# Altium project BUCK-BOOST_PFC_Mainboard.PrjPcb
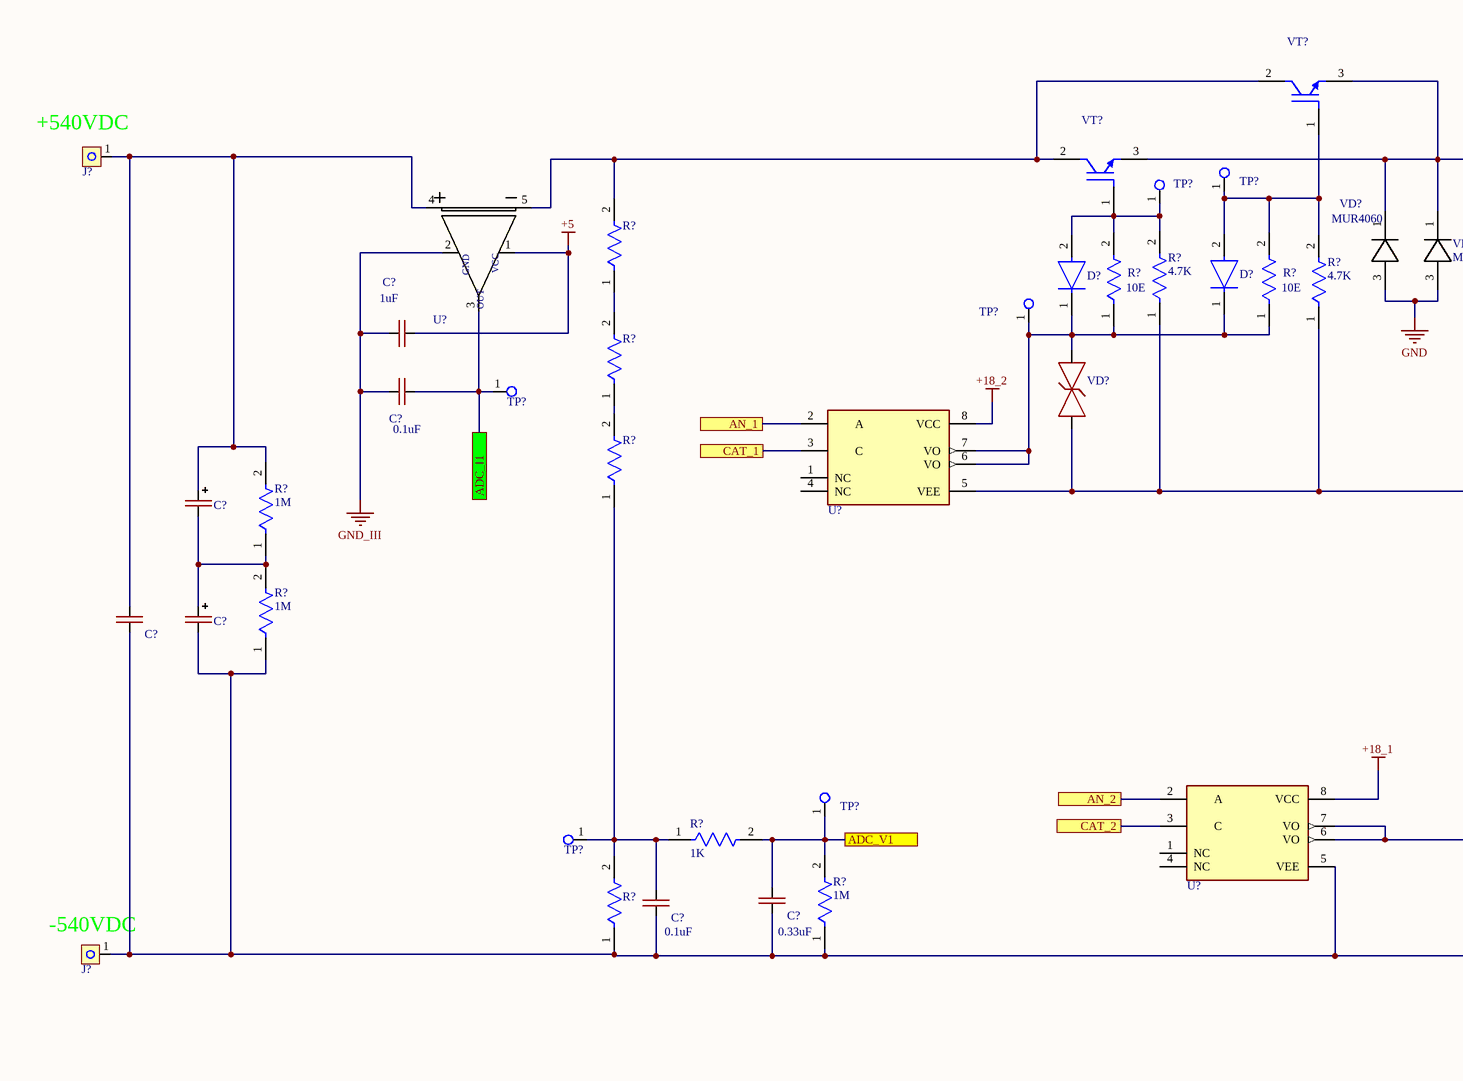
[diagram p0: BUCK-BOOST_PFC_Mainboard_.SchDoc, top left]
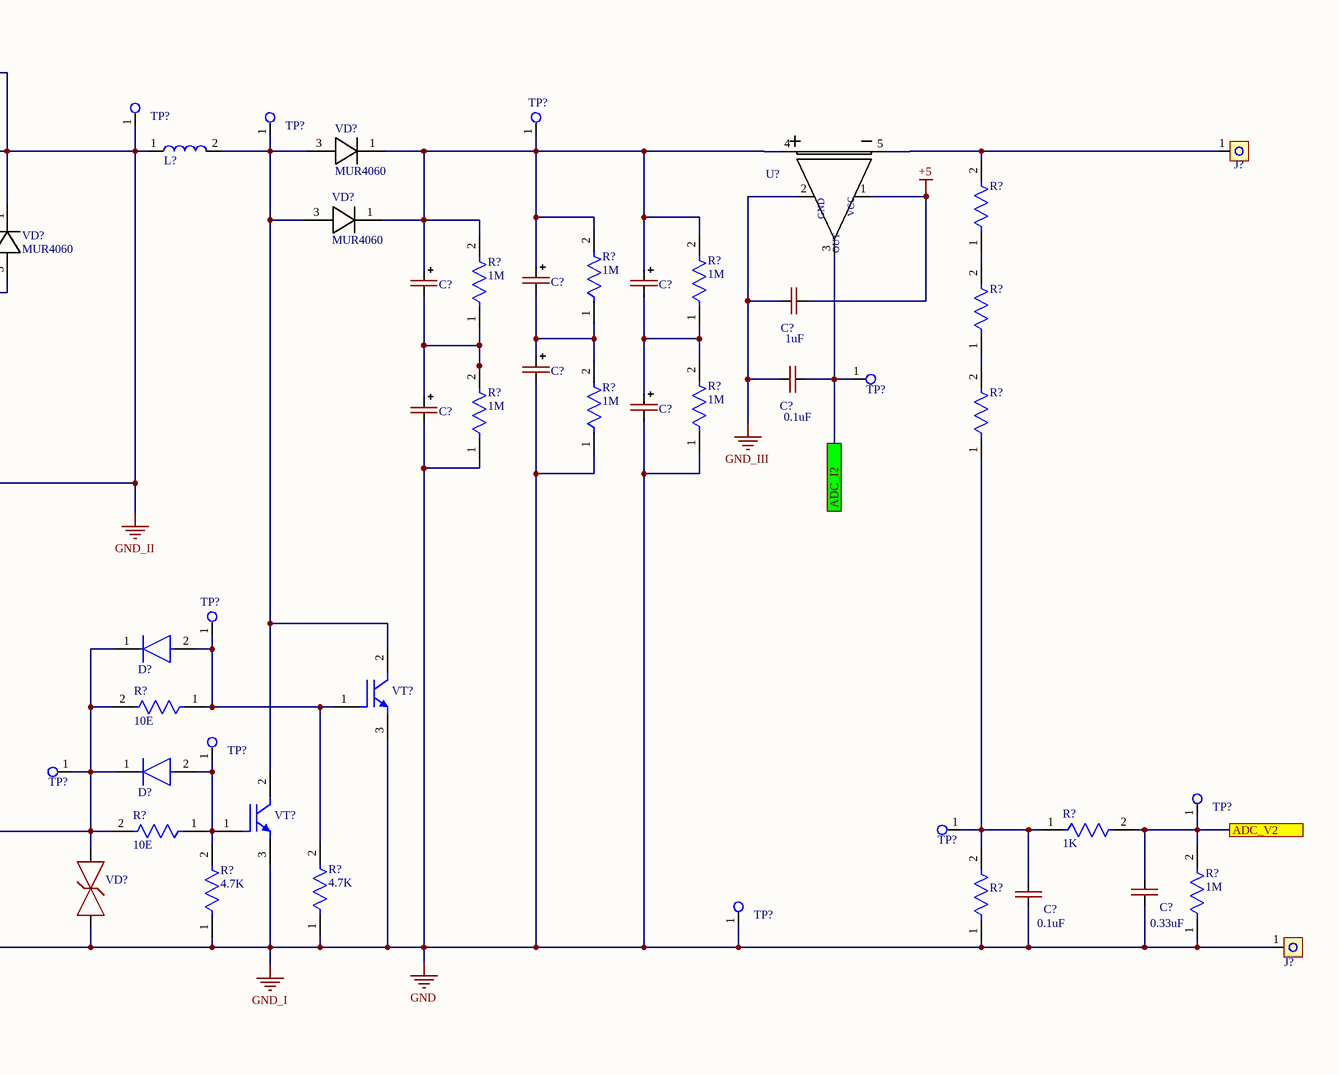
[diagram p1: BUCK-BOOST_PFC_Mainboard_.SchDoc, top right]
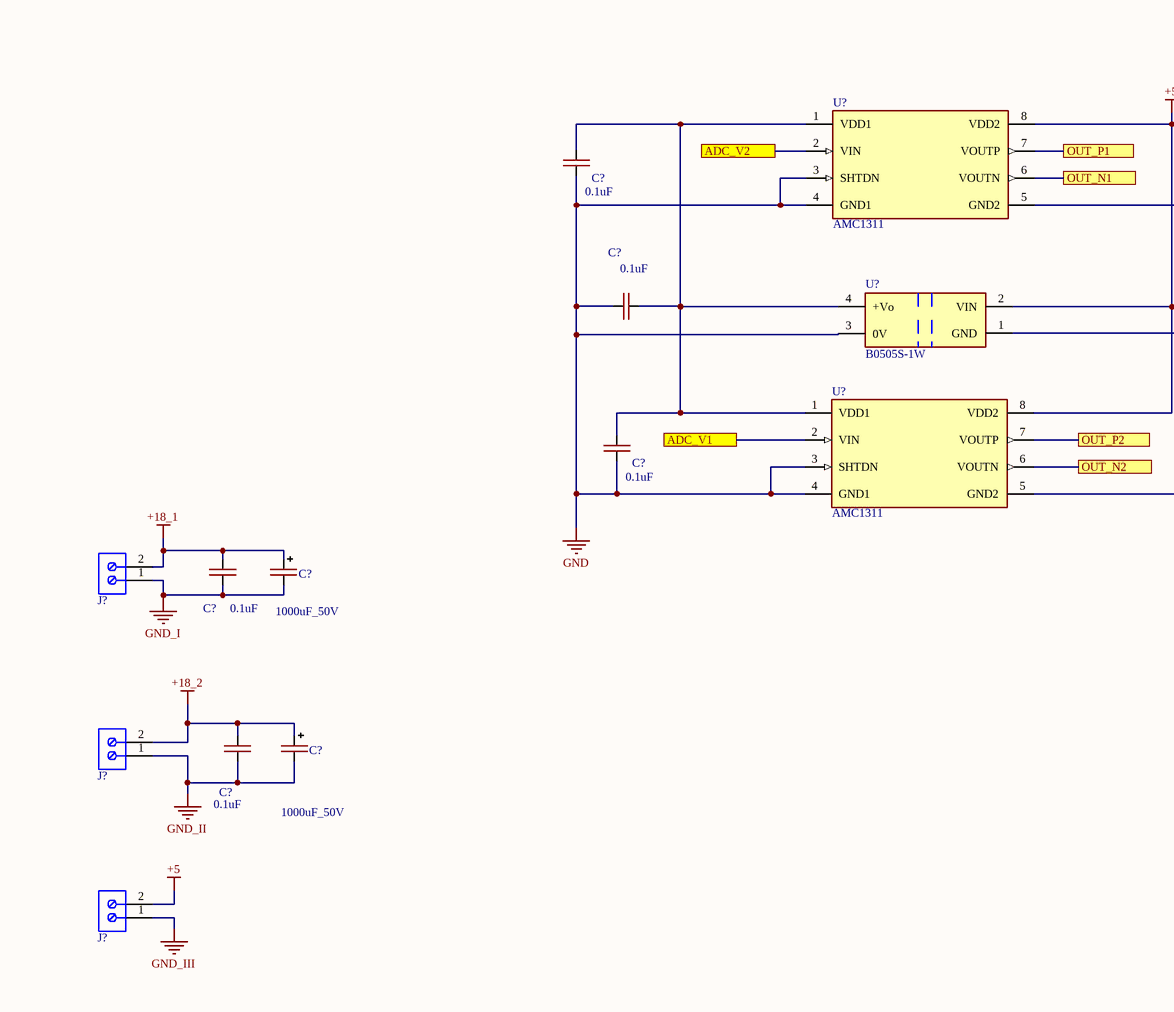
[diagram p2: BUCK-BOOST_PFC_Mainboard_.SchDoc, bottom left]
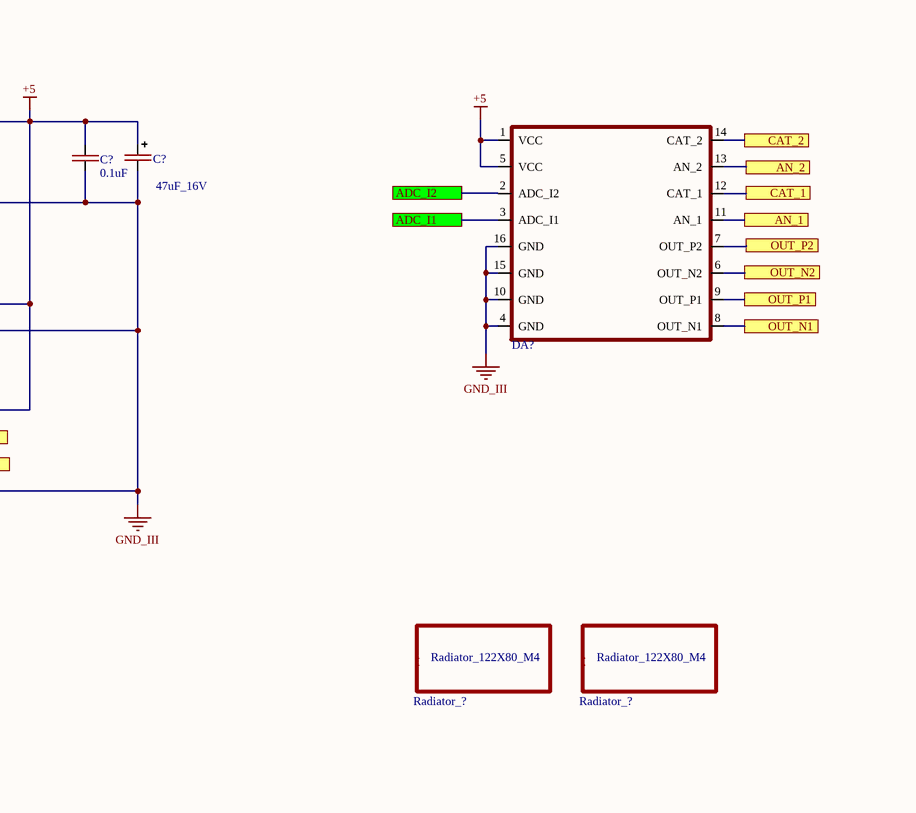
[diagram p3: BUCK-BOOST_PFC_Mainboard_.SchDoc, bottom right]
1 sheet, 102 parts. Net scope: flat (ports and power ports of the same name join across sheets).
Board file: BUCK-BOOST_PFC_Mainboard.PcbDoc

## Sheet BUCK-BOOST_PFC_Mainboard_.SchDoc
size A0; SheetNumber: 1; SheetTotal: 1; SPICEModelCacheFPQAHQWD: <root> / <DocumentId>FPQAHQWD</DocumentId> / </root>

### Parts
(Parts that share a designator on the sheet are numbered #1, #2 ... from top to bottom, then left to right.)
C?#1  CAP-POLAR  [CAP 100uF_500V 22x40mm]  (value not drawn)
C?#2  CAP-POLAR  [CAP 100uF_500V 22x40mm]  (value not drawn)
C?#3  CAP-POLAR  [CAP 100uF_500V 22x40mm]  (value not drawn)
C?#4  1uF  [CAP-0805]
C?#5  1uF  [CAP-0805]
C?#6  CAP-POLAR  [CAP 100uF_500V 22x40mm]  (value not drawn)
C?#7  0.1uF  [CAP-0805]
C?#8  0.1uF  [CAP-0805]
C?#9  CAP-POLAR  [CAP 100uF_500V 22x40mm]  (value not drawn)
C?#10  CAP-POLAR  [CAP 100uF_500V 22x40mm]  (value not drawn)
C?#11  CAP-POLAR  [CAP_POL_36X60]  (value not drawn)
C?#12  CAP-NON-POLAR  [CAP_4.7uF_630V]  (value not drawn)
C?#13  CAP-POLAR  [CAP_POL_36X60]  (value not drawn)
C?#14  0.1uF  [CAP-0805]
C?#15  0.33uF  [CAP-0805]
C?#16  0.1uF  [CAP-0805]
C?#17  0.33uF  [CAP-0805]
C?#18  0.1uF  [CAP-0805]
C?#19  0.1uF  [CAP-0805]
C?#20  47uF_16V  [CAP-TAN-D]
C?#21  0.1uF  [CAP-0805]
C?#22  0.1uF  [CAP-0805]
C?#23  0.1uF  [CAP-0805]
C?#24  1000uF_50V  [CAPPOL-16x25]
C?#25  0.1uF  [CAP-0805]
C?#26  1000uF_50V  [CAPPOL-16x25]
D?#1  US1G  [DO-214AA]  (value not drawn)
D?#2  US1G  [DO-214AA]  (value not drawn)
D?#3  US1G  [DO-214AA]  (value not drawn)
D?#4  US1G  [DO-214AA]  (value not drawn)
DA?  BOARD_PFC  [BOARD_PFC]  (value not drawn)
J?#1  MG_136_HT  [Conn_MEIGAN_MG136HT]  (value not drawn)
J?#2  MG_136_HT  [Conn_MEIGAN_MG136HT]  (value not drawn)
J?#3  MG_136_HT  [Conn_MEIGAN_MG136HT]  (value not drawn)
J?#4  MG_136_HT  [Conn_MEIGAN_MG136HT]  (value not drawn)
J?#5  691102710002  [691102710002]  (value not drawn)
J?#6  691102710002  [691102710002]  (value not drawn)
J?#7  691102710002  [691102710002]  (value not drawn)
L?  Coil  [30A_10uH]  (value not drawn)
R?#1  (no value)  [RES-2512]
R?#2  (no value)  [RES-2512]
R?#3  10E  [RES_SMD_1210_IPC_A]
R?#4  4.7K  [RES-0805]
R?#5  10E  [RES_SMD_1210_IPC_A]
R?#6  4.7K  [RES-0805]
R?#7  1M  [RES-2512]
R?#8  1M  [RES-2512]
R?#9  1M  [RES-2512]
R?#10  (no value)  [RES-2512]
R?#11  (no value)  [RES-2512]
R?#12  1M  [RES-2512]
R?#13  1M  [RES-2512]
R?#14  1M  [RES-2512]
R?#15  (no value)  [RES-2512]
R?#16  (no value)  [RES-2512]
R?#17  1M  [RES-2512]
R?#18  1M  [RES-2512]
R?#19  10E  [RES_SMD_1210_IPC_A]
R?#20  1K  [RES-0805]
R?#21  10E  [RES_SMD_1210_IPC_A]
R?#22  1K  [RES-0805]
R?#23  RES_1210  [RES_SMD_1210_IPC_B]  (value not drawn)
R?#24  1M  [RES-0805]
R?#25  4.7K  [RES-0805]
R?#26  4.7K  [RES-0805]
R?#27  RES_1210  [RES_SMD_1210_IPC_B]  (value not drawn)
R?#28  1M  [RES-0805]
Radiator_?#1  Radiator_122X80_M4  [Radiator_122X80_M4]  (value not drawn)
Radiator_?#2  Radiator_122X80_M4  [Radiator_122X80_M4]  (value not drawn)
TP?#1  Test_Point_PCB  [Test_Point]  (value not drawn)
TP?#2  Test_Point_PCB  [Test_Point]  (value not drawn)
TP?#3  Test_Point_PCB  [Test_Point]  (value not drawn)
TP?#4  Test_Point_PCB  [Test_Point]  (value not drawn)
TP?#5  Test_Point_PCB  [Test_Point]  (value not drawn)
TP?#6  Test_Point_PCB  [Test_Point]  (value not drawn)
TP?#7  Test_Point_PCB  [Test_Point]  (value not drawn)
TP?#8  Test_Point_PCB  [Test_Point]  (value not drawn)
TP?#9  Test_Point_PCB  [Test_Point]  (value not drawn)
TP?#10  Test_Point_PCB  [Test_Point]  (value not drawn)
TP?#11  Test_Point_PCB  [Test_Point]  (value not drawn)
TP?#12  Test_Point_PCB  [Test_Point]  (value not drawn)
TP?#13  Test_Point_PCB  [Test_Point]  (value not drawn)
TP?#14  Test_Point_PCB  [Test_Point]  (value not drawn)
TP?#15  Test_Point_PCB  [Test_Point]  (value not drawn)
TP?#16  Test_Point_PCB  [Test_Point]  (value not drawn)
U?#1  ACS758  [ACS758-100]  (value not drawn)
U?#2  ACS758  [ACS758-100]  (value not drawn)
U?#3  HCPL-3120  [HCPL-3120]  (value not drawn)
U?#4  HCPL-3120  [HCPL-3120]  (value not drawn)
U?#5  AMC1311  [FP-DWV0008A-MFG]
U?#6  B0505S-1W  [B0505S-1W]
U?#7  AMC1311  [FP-DWV0008A-MFG]
VD?#1  MUR4060  [TO-247-2]
VD?#2  MUR4060  [TO-247-2]
VD?#3  MUR4060  [TO-247-2]
VD?#4  MUR4060  [TO-247-2]
VD?#5  Suppressor  [DO-214AA]  (value not drawn)
VD?#6  Suppressor  [DO-214AA]  (value not drawn)
VT?#1  IGBT 60N120T  [TO-264-3]  (value not drawn)
VT?#2  IGBT 60N120T  [TO-264-3]  (value not drawn)
VT?#3  IGBT 60N120T  [TO-264-3]  (value not drawn)
VT?#4  IGBT 60N120T  [TO-264-3]  (value not drawn)

### Ports
ADC_I1, ADC_I2, ADC_V1, ADC_V2, AN_1, AN_2, CAT_1, CAT_2, OUT_N1, OUT_N2, OUT_P1, OUT_P2

### Nets
+5: C?#4.2 C?#5.2 C?#19.1 C?#20.1(+) DA?.1(VCC) DA?.5(VCC) J?#7.2 U?#1.1(+VCC) U?#2.1(+VCC) U?#5.8(VDD2) U?#6.2(VIN) U?#7.8(VDD2)
+18_1: C?#23.2 C?#24.1(+) J?#5.2 U?#4.8(VCC)
+18_2: C?#25.2 C?#26.1(+) J?#6.2 U?#3.8(VCC)
GND: C?#6.2(-) C?#9.2(-) C?#10.2(-) C?#12.1 C?#13.2(-) C?#14.1 C?#15.1 C?#16.1 C?#17.1 C?#18.1 C?#21.2 C?#22.1 C?#23.1 C?#24.2(-) J?#3.1 J?#4.1 J?#5.1 R?#12.1 R?#13.1 R?#14.1 R?#18.1 R?#23.1 R?#24.1 R?#25.1 R?#26.1 R?#27.1 R?#28.1 TP?#16.1(G9) U?#4.5(VEE) U?#5.3(SHTDN) U?#5.4(GND1) U?#6.3(0V) U?#7.3(SHTDN) U?#7.4(GND1) VD?#3.3 VD?#4.3 VD?#6.1(C) VT?#3.3(E) VT?#4.3(E)  [also labelled GND_I]
GND_II: C?#25.1 C?#26.2(-) J?#6.1 L?.1 R?#4.1 R?#6.1 TP?#1.1(G9) U?#3.5(VEE) VD?#3.1 VD?#4.1 VD?#5.1(C) VT?#1.3(E) VT?#2.3(E)
GND_III: C?#4.1 C?#5.1 C?#7.1 C?#8.1 C?#19.2 C?#20.2(-) DA?.4(GND) DA?.10(GND) DA?.15(GND) DA?.16(GND) J?#7.1 U?#1.2(GND) U?#2.2(GND) U?#5.5(GND2) U?#6.1(GND) U?#7.5(GND2)
NetC?#1_1: C?#1.1(+) C?#2.1(+) C?#3.1(+) R?#7.2 R?#8.2 R?#9.2 TP?#3.1(G9) U?#1.4(+IP) VD?#1.1 VD?#2.1
NetC?#1_2: C?#1.2(-) C?#6.1(+) R?#7.1 R?#12.2
NetC?#2_2: C?#2.2(-) C?#10.1(+) R?#8.1 R?#14.2
NetC?#3_2: C?#3.2(-) C?#9.1(+) R?#9.1 R?#13.2
NetC?#7_2: C?#7.2 DA?.2(ADC_I2) TP?#7.1(G9) U?#1.3(OUT) ; port ADC_I2
NetC?#8_2: C?#8.2 DA?.3(ADC_I1) TP?#8.1(G9) U?#2.3(OUT) ; port ADC_I1
NetC?#11_1: C?#11.1(+) C?#12.2 J?#1.1 R?#17.2 U?#2.4(+IP)
NetC?#11_2: C?#11.2(-) C?#13.1(+) R?#17.1 R?#18.2
NetC?#14_2: C?#14.2 R?#16.1 R?#20.1 R?#23.2 TP?#14.1(G9)
NetC?#15_2: C?#15.2 R?#20.2 R?#24.2 TP?#12.1(G9) U?#7.2(VIN) ; port ADC_V1
NetC?#16_2: C?#16.2 R?#15.1 R?#22.1 R?#27.2 TP?#15.1(G9)
NetC?#17_2: C?#17.2 R?#22.2 R?#28.2 TP?#13.1(G9) U?#5.2(VIN) ; port ADC_V2
NetC?#18_2: C?#18.2 C?#21.1 C?#22.2 U?#5.1(VDD1) U?#6.4(+Vo) U?#7.1(VDD1)
NetD?#1_1: D?#1.1(C) D?#2.1(C) R?#3.1 R?#5.1 TP?#6.1(G9) U?#3.6(VO) U?#3.7(VO) VD?#5.2(A)
NetD?#1_2: D?#1.2(A) R?#3.2 R?#4.2 TP?#5.1(G9) VT?#2.1(G)
NetD?#2_2: D?#2.2(A) R?#5.2 R?#6.2 TP?#4.1(G9) VT?#1.1(G)
NetD?#3_1: D?#3.1(C) D?#4.1(C) R?#19.2 R?#21.2 TP?#11.1(G9) U?#4.6(VO) U?#4.7(VO) VD?#6.2(A)
NetD?#3_2: D?#3.2(A) R?#19.1 R?#26.2 TP?#9.1(G9) VT?#3.1(G)
NetD?#4_2: D?#4.2(A) R?#21.1 R?#25.2 TP?#10.1(G9) VT?#4.1(G)
NetDA?_6: DA?.6(OUT_N2) U?#7.6(VOUTN) ; port OUT_N2
NetDA?_7: DA?.7(OUT_P2) U?#7.7(VOUTP) ; port OUT_P2
NetDA?_8: DA?.8(OUT_N1) U?#5.6(VOUTN) ; port OUT_N1
NetDA?_9: DA?.9(OUT_P1) U?#5.7(VOUTP) ; port OUT_P1
NetDA?_11: DA?.11(AN_1) U?#3.2(A) ; port AN_1
NetDA?_12: DA?.12(CAT_1) U?#3.3(C) ; port CAT_1
NetDA?_13: DA?.13(AN_2) U?#4.2(A) ; port AN_2
NetDA?_14: DA?.14(CAT_2) U?#4.3(C) ; port CAT_2
NetJ?#2_1: J?#2.1 R?#1.2 U?#1.5(-IP)
NetL?_2: L?.2 TP?#2.1(G9) VD?#1.3 VD?#2.3 VT?#3.2(C) VT?#4.2(C)
NetR?#1_1: R?#1.1 R?#10.2
NetR?#2_1: R?#2.1 R?#11.2
NetR?#2_2: R?#2.2 U?#2.5(-IP) VT?#1.2(C) VT?#2.2(C)
NetR?#10_1: R?#10.1 R?#15.2
NetR?#11_1: R?#11.1 R?#16.2

Not connected (* = marked no-connect by the designer): U?#3 1(NC) 4(NC); U?#4 1(NC) 4(NC)

### Notes on the sheet
- (near J?#1) +540VDC
- (near J?#3) -540VDC
- (in symbol ACS758) VCC

### Library data of the parts
C?#4 C?#5 C?#7 C?#8 C?#14-C?#19 C?#21-C?#23 C?#25 = CAP-NON-POLAR
C?#20 C?#24 C?#26 = CAP-POLAR
J?#1-J?#4 = Connector_MEIGAN_MG136HT
J?#5-J?#7 = 691102710002: WR-TBL Series 102 Horizontal Entry Modular, THT, pitch 5mm, 2p; Manufacturer: Wurth Elektronik; Modularity: Yes; Rated Current: 15A; Working Voltage: 250V; ComponentLink1Description: Website Link; ComponentLink1URL: https://www.we-online.com/redexpert/article/691102710002?ad; ComponentLink2Description: Datasheet Link; ComponentLink2URL: https://www.we-online.com/redexpert/spec/691102710002?ad; Manufacturer Part Number: 691102710002; Category: Terminal Blocks; Match Code: WR-TBL; Mount: Through Hole; Operating Temperature Max: 105°C; Operating Temperature Min: -40°C; Packaging: Box; Application: Pressure Clamp; Number of Pins: 2; Number of Rows: 1; Orientation: Horizontal; Pitch: 5mm
R?#1 R?#2 R?#4 R?#6 R?#10 R?#11 R?#15 R?#16 R?#20 R?#22 R?#24-R?#26 R?#28 = RES-CONST
R?#3 R?#5 R?#19 R?#21 = RES_1210
R?#7-R?#9 R?#12-R?#14 R?#17 R?#18 = RES-CONST: 4.7K
TP?#1-TP?#16 = TP_PCB?: Test_Point
VT?#1-VT?#4 = IGBT 60N120T: IGBT 60N120T TO-264-3